# EasyEDA schematic Drainer.json
TITLE: Drainer; REV: 1.1; Date: 2026-05-31; Sheet: 1/1; Company: Your Company
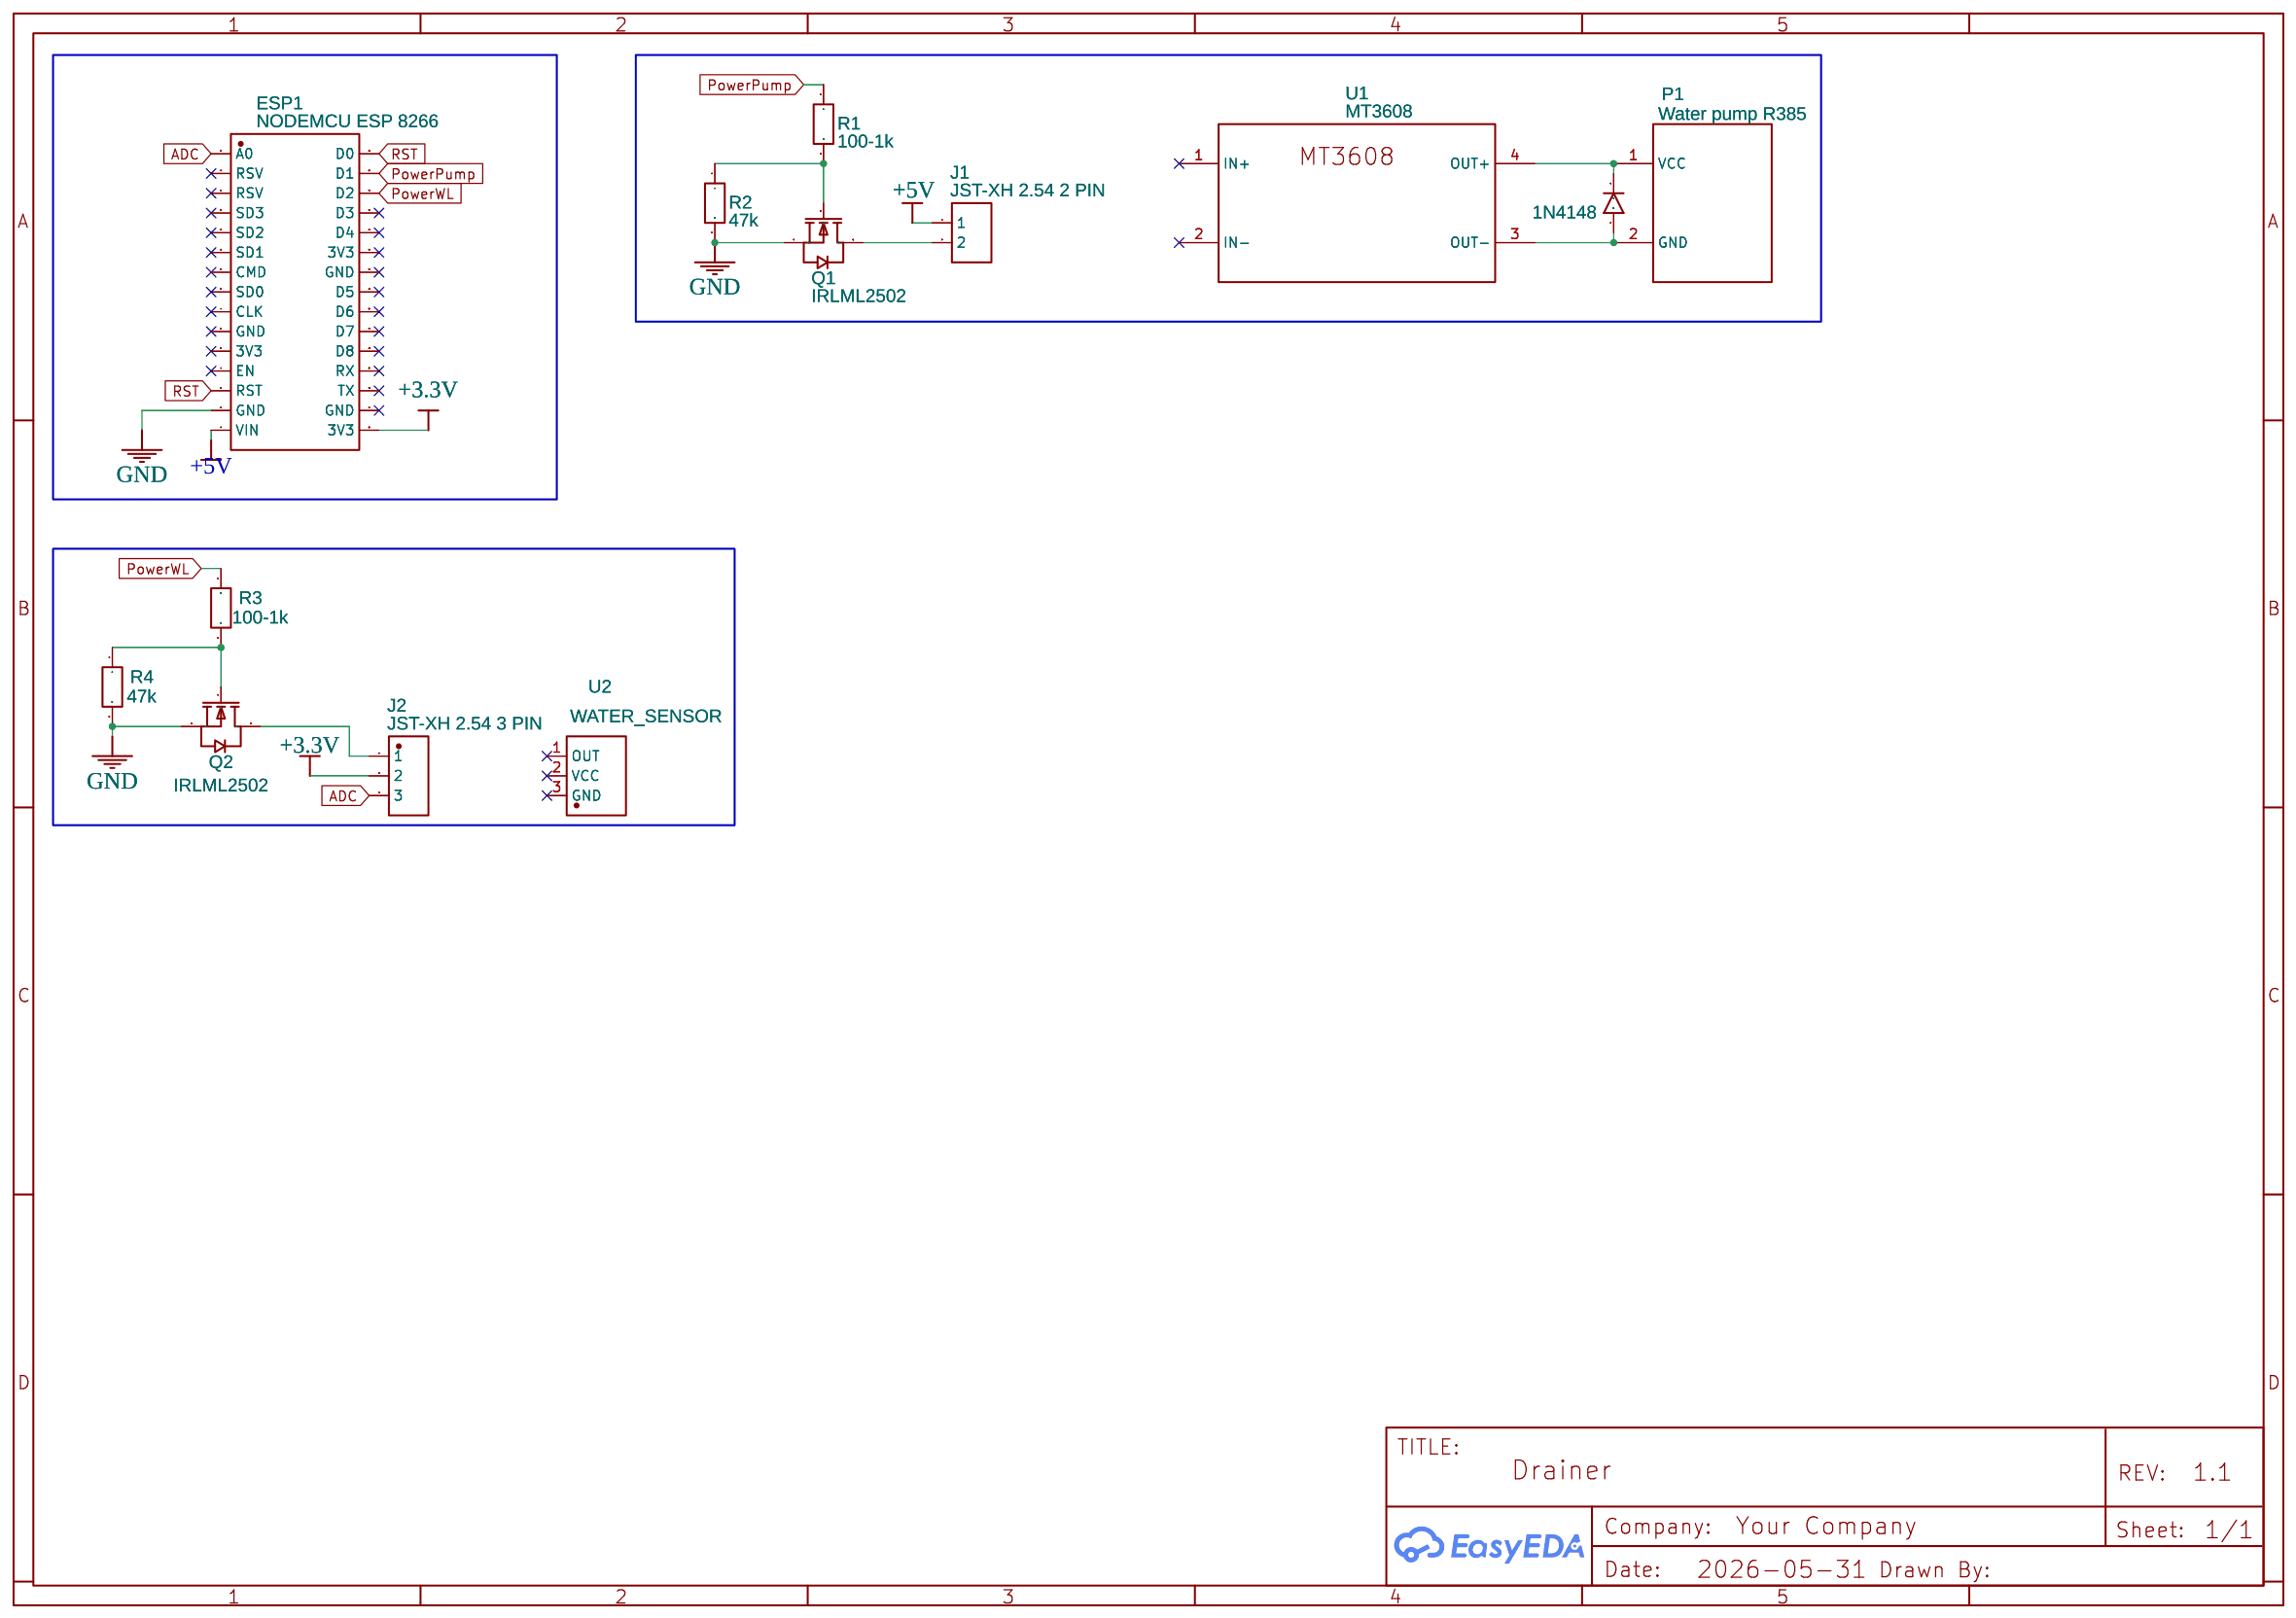
[diagram p0: schematic sheet]

## Parts
D1  1N4148  [DO-35_BD2.2-L4.0-D0.50_1N4148]
ESP1  NODEMCU ESP 8266  [NODEMCU-12E;NODEMCU-ESP8266]
J1  JST-XH 2.54 2 PIN  [2PIN_2.54_MM_JST_XHP_JST_CONNECTOR_FOR_DC_SOCKET]
J2  JST-XH 2.54 3 PIN  [3PIN_2.54_MM_JST_XHP_JST_CONNECTOR-TRUNG]
P1  Water pump R385  [R385]
Q1  IRLML2502  [SOT-23_L2.9-W1.3-P1.90-LS2.4-BR]
Q2  IRLML2502  [SOT-23_L2.9-W1.3-P1.90-LS2.4-BR]
R1  100-1k  [RC07]
R2  47k  [RC07]
R3  100-1k  [RC07]
R4  47k  [RC07]
U1  MT3608  [MT3608]
U2  WATER_SENSOR  [WATER_SENSOR]

## Library data of the parts
D1 = 1N4148: Contributor: PAK Engineering Tech
ESP1 = NODEMCU ESP 8266: Contributor: hreehoorn; Package Display: No
J1 = JST-XH 2.54 2 PIN: Contributor: J.cruz; Package Display: No
J2 = JST_3Pin_2.54mm: Contributor: 123ei0594
P1 = R385: Contributor: bernales.vargas
Q1 Q2 = IRLML2502: Contributor: LCSC; Supplier: LCSC; Supplier Part: C347503; Manufacturer: UMW(友台半导体); Manufacturer Part: IRLML2502TR(UMW); JLCPCB Part Class: Extended Part
R1-R3 = R_0603_EU: Contributor: LCEDA_Lib
R4 = R_0603_EU: Contributor: LCEDA_Lib; Package Display: No
U1 = MT3608: Contributor: kollega
U2 = WATER_SENSOR: Contributor: emo.sintur-nt

## Nets
+3.3V: ESP1.16(3V3) J2.2
+5V: ESP1.1(VIN) J1.1
GND: ESP1.2(GND) Q1.2(S) Q2.2(S) R2.2 R4.2
ADC: ESP1.15(A0) J2.3
PowerPump: ESP1.29(D1) R1.1
PowerWL: ESP1.28(D2) R3.1
RST: ESP1.3(RST) ESP1.30(D0)
Net-(D1-1): D1.1(2) P1.2(GND) U1.3(OUT-)
Net-(D1-2): D1.2(1) P1.1(VCC) U1.4(OUT+)
Net-(J1-2): J1.2 Q1.3(D)
Net-(J2-1): J2.1 Q2.3(D)
Net-(Q1-1): Q1.1(G) R1.2 R2.1
Net-(Q2-1): Q2.1(G) R3.2 R4.1

Not connected (* = marked no-connect by the designer): ESP1 4(EN)* 5(3V3)* 6(GND)* 7(CLK)* 8(SD0)* 9(CMD)* 10(SD1)* 11(SD2)* 12(SD3)* 13(RSV)* 14(RSV)* 17(GND)* 18(TX)* 19(RX)* 20(D8)* 21(D7)* 22(D6)* 23(D5)* 24(GND)* 25(3V3)* 26(D4)* 27(D3)*; U1 1(IN+)* 2(IN-)*; U2 1(OUT)* 2(VCC)* 3(GND)*
